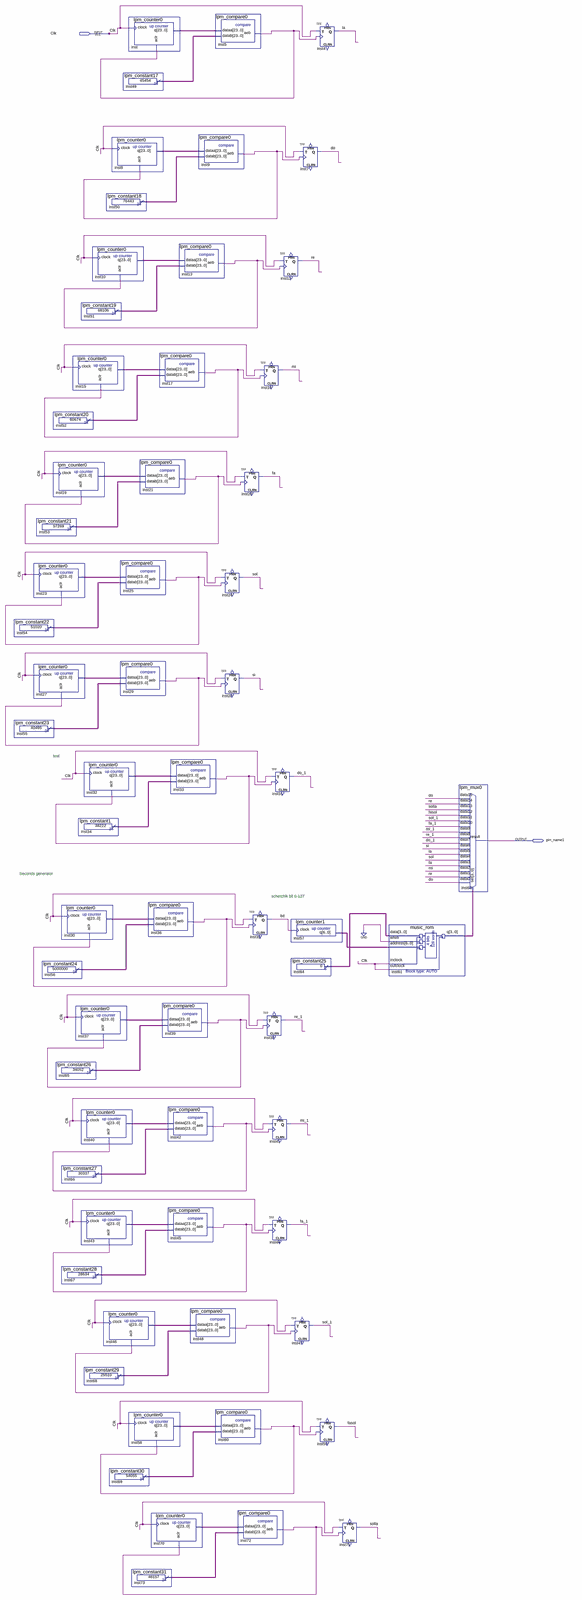
[diagram p0: schematic sheet, whole]
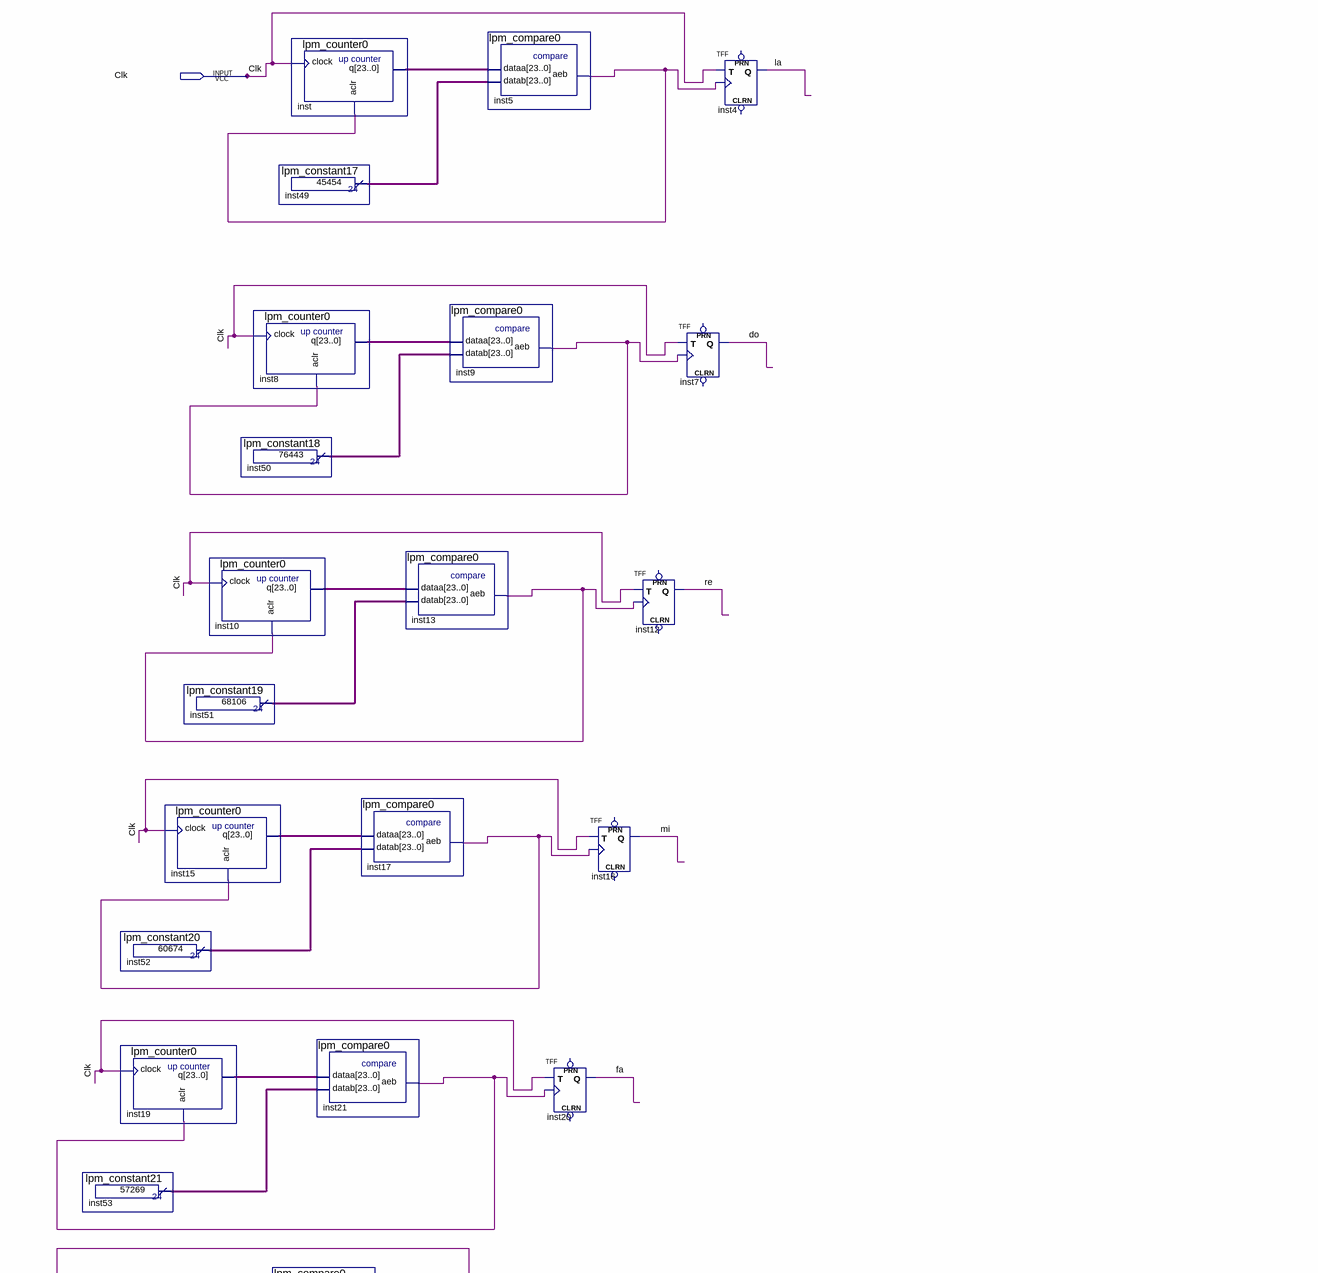
[diagram p1: schematic sheet, upper part]
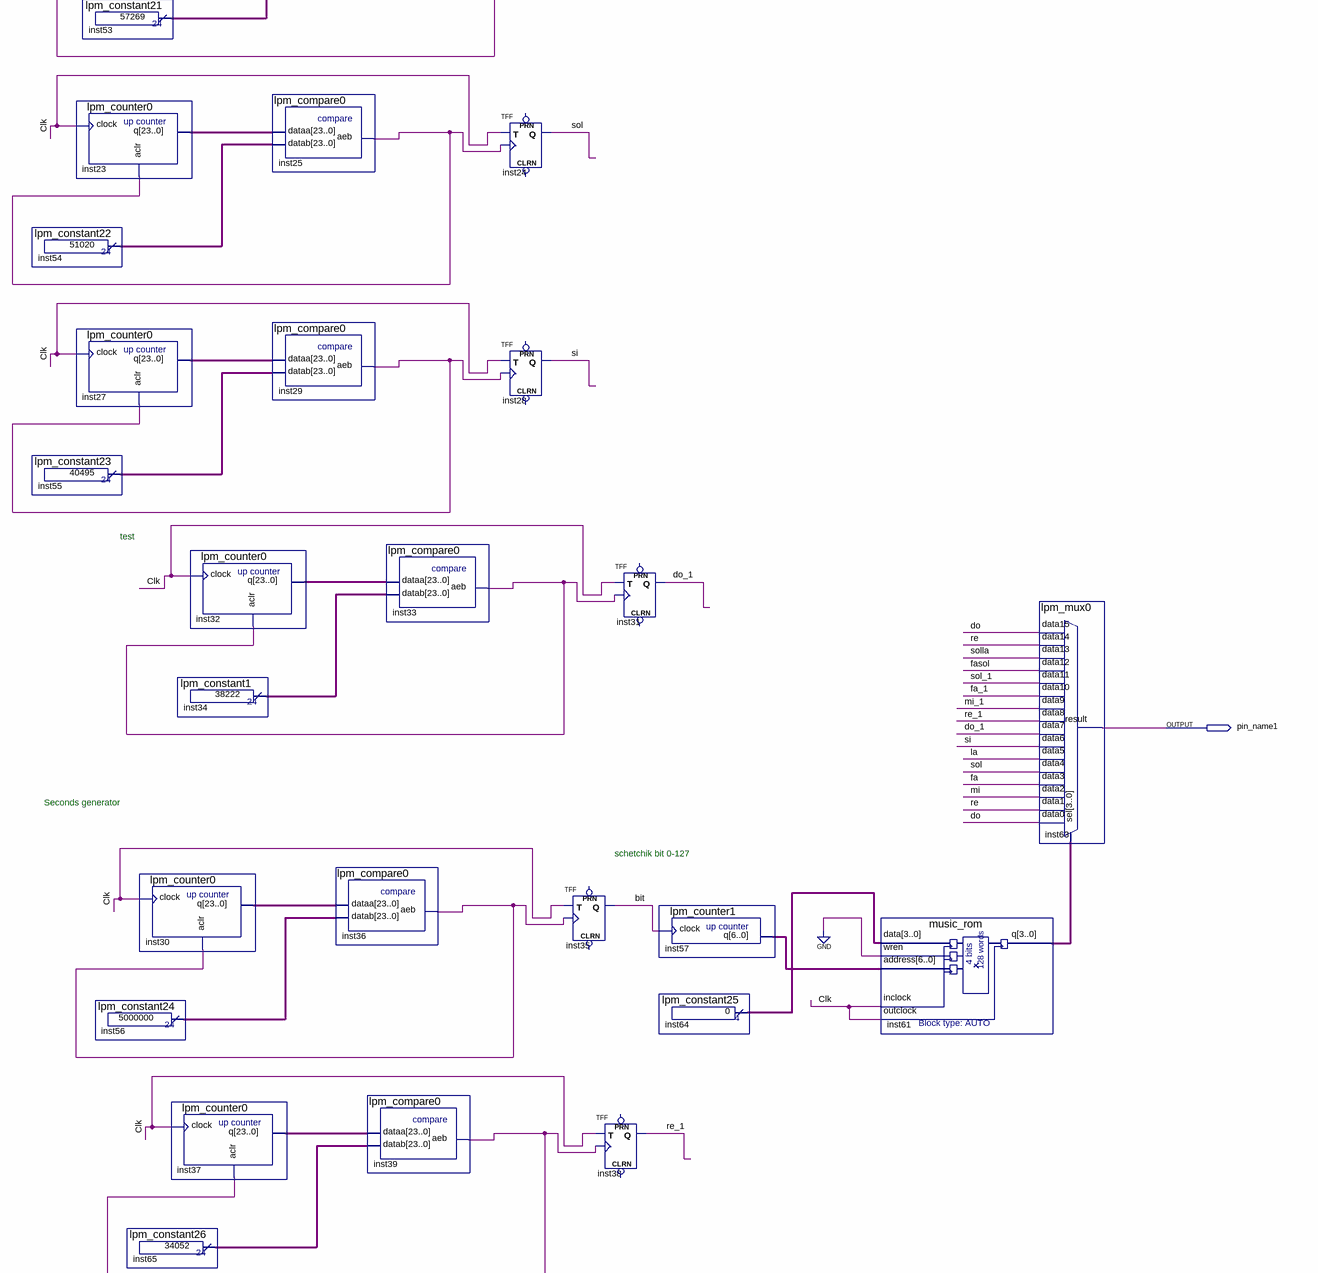
[diagram p2: schematic sheet, middle part]
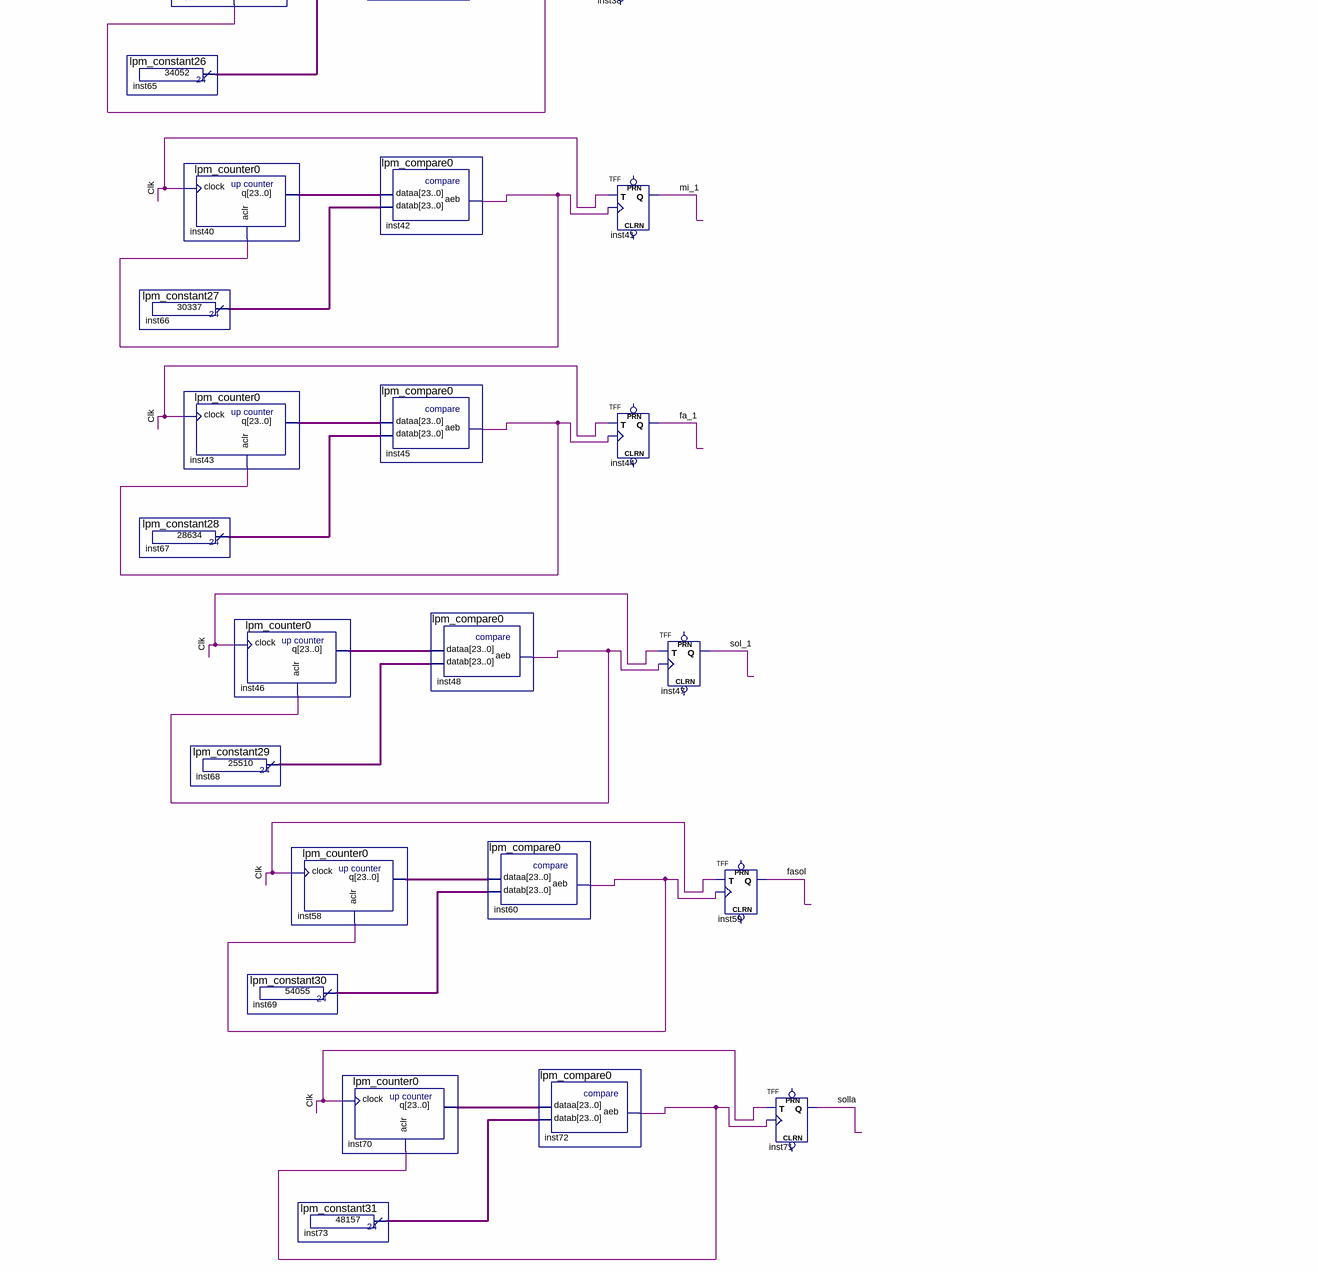
[diagram p3: schematic sheet, lower part]
// Quartus schematic MUSIC.bdf as structural Verilog: 64 symbols, 2 pins
module MUSIC (
  input  Clk,
  output pin_name1
);

  wire \bit , \do , do_1, fa, fa_1, fasol, inst5_aeb, inst9_aeb, inst13_aeb, inst17_aeb, inst21_aeb,
       inst25_aeb, inst29_aeb, inst33_aeb, inst36_aeb, inst39_aeb, inst42_aeb, inst45_aeb, inst48_aeb,
       inst60_aeb, inst72_aeb, la, mi, mi_1, re, re_1, si, sol, sol_1, solla;
  wire [3:0] inst61_q, inst64_result;
  wire [6:0] inst57_q;
  wire [23:0] inst8_q, inst10_q, inst15_q, inst19_q, inst23_q, inst27_q, inst30_q, inst32_q, inst34_result,
       inst37_q, inst40_q, inst43_q, inst46_q, inst49_result, inst50_result, inst51_result, inst52_result,
       inst53_result, inst54_result, inst55_result, inst56_result, inst58_q, inst65_result, inst66_result,
       inst67_result, inst68_result, inst69_result, inst70_q, inst73_result, inst_q;

  lpm_constant22 inst54 (.result(inst54_result));
  lpm_constant23 inst55 (.result(inst55_result));
  lpm_constant21 inst53 (.result(inst53_result));
  lpm_counter0 inst23 (.clock(Clk), .aclr(inst25_aeb), .q(inst23_q));
  lpm_counter0 inst27 (.clock(Clk), .aclr(inst29_aeb), .q(inst27_q));
  lpm_constant24 inst56 (.result(inst56_result));
  lpm_constant20 inst52 (.result(inst52_result));
  lpm_counter0 inst19 (.clock(Clk), .aclr(inst21_aeb), .q(inst19_q));
  lpm_counter0 inst30 (.clock(Clk), .aclr(inst36_aeb), .q(inst30_q));
  lpm_constant26 inst65 (.result(inst65_result));
  lpm_constant27 inst66 (.result(inst66_result));
  lpm_constant28 inst67 (.result(inst67_result));
  lpm_constant19 inst51 (.result(inst51_result));
  lpm_counter0 inst15 (.clock(Clk), .aclr(inst17_aeb), .q(inst15_q));
  lpm_counter0 inst32 (.clock(Clk), .aclr(inst33_aeb), .q(inst32_q));
  lpm_constant1 inst34 (.result(inst34_result));
  lpm_counter0 inst37 (.clock(Clk), .aclr(inst39_aeb), .q(inst37_q));
  lpm_counter0 inst40 (.clock(Clk), .aclr(inst42_aeb), .q(inst40_q));
  lpm_counter0 inst43 (.clock(Clk), .aclr(inst45_aeb), .q(inst43_q));
  lpm_constant29 inst68 (.result(inst68_result));
  lpm_constant18 inst50 (.result(inst50_result));
  lpm_counter0 inst10 (.clock(Clk), .aclr(inst13_aeb), .q(inst10_q));
  lpm_counter0 inst46 (.clock(Clk), .aclr(inst48_aeb), .q(inst46_q));
  lpm_constant30 inst69 (.result(inst69_result));
  lpm_counter0 inst (.clock(Clk), .aclr(inst5_aeb), .q(inst_q));
  lpm_constant17 inst49 (.result(inst49_result));
  lpm_counter0 inst8 (.clock(Clk), .aclr(inst9_aeb), .q(inst8_q));
  lpm_compare0 inst25 (.dataa(inst23_q), .datab(inst54_result), .aeb(inst25_aeb));
  lpm_compare0 inst29 (.dataa(inst27_q), .datab(inst55_result), .aeb(inst29_aeb));
  lpm_counter0 inst58 (.clock(Clk), .aclr(inst60_aeb), .q(inst58_q));
  lpm_constant31 inst73 (.result(inst73_result));
  lpm_compare0 inst21 (.dataa(inst19_q), .datab(inst53_result), .aeb(inst21_aeb));
  lpm_compare0 inst36 (.dataa(inst30_q), .datab(inst56_result), .aeb(inst36_aeb));
  lpm_counter0 inst70 (.clock(Clk), .aclr(inst72_aeb), .q(inst70_q));
  lpm_compare0 inst17 (.dataa(inst15_q), .datab(inst52_result), .aeb(inst17_aeb));
  lpm_compare0 inst33 (.dataa(inst32_q), .datab(inst34_result), .aeb(inst33_aeb));
  lpm_compare0 inst39 (.dataa(inst37_q), .datab(inst65_result), .aeb(inst39_aeb));
  lpm_compare0 inst42 (.dataa(inst40_q), .datab(inst66_result), .aeb(inst42_aeb));
  lpm_compare0 inst45 (.dataa(inst43_q), .datab(inst67_result), .aeb(inst45_aeb));
  lpm_compare0 inst9 (.dataa(inst8_q), .datab(inst50_result), .aeb(inst9_aeb));
  lpm_compare0 inst13 (.dataa(inst10_q), .datab(inst51_result), .aeb(inst13_aeb));
  lpm_compare0 inst48 (.dataa(inst46_q), .datab(inst68_result), .aeb(inst48_aeb));
  lpm_compare0 inst5 (.dataa(inst_q), .datab(inst49_result), .aeb(inst5_aeb));
  TFF inst24 (.T(Clk), .CLK(inst25_aeb), .Q(sol));  // open: PRN, CLRN
  TFF inst28 (.T(Clk), .CLK(inst29_aeb), .Q(si));  // open: PRN, CLRN
  lpm_compare0 inst60 (.dataa(inst58_q), .datab(inst69_result), .aeb(inst60_aeb));
  TFF inst20 (.T(Clk), .CLK(inst21_aeb), .Q(fa));  // open: PRN, CLRN
  lpm_compare0 inst72 (.dataa(inst70_q), .datab(inst73_result), .aeb(inst72_aeb));
  TFF inst16 (.T(Clk), .CLK(inst17_aeb), .Q(mi));  // open: PRN, CLRN
  TFF inst35 (.T(Clk), .CLK(inst36_aeb), .Q(\bit ));  // open: PRN, CLRN
  TFF inst38 (.T(Clk), .CLK(inst39_aeb), .Q(re_1));  // open: PRN, CLRN
  TFF inst12 (.T(Clk), .CLK(inst13_aeb), .Q(re));  // open: PRN, CLRN
  TFF inst31 (.T(Clk), .CLK(inst33_aeb), .Q(do_1));  // open: PRN, CLRN
  TFF inst41 (.T(Clk), .CLK(inst42_aeb), .Q(mi_1));  // open: PRN, CLRN
  TFF inst44 (.T(Clk), .CLK(inst45_aeb), .Q(fa_1));  // open: PRN, CLRN
  TFF inst7 (.T(Clk), .CLK(inst9_aeb), .Q(\do ));  // open: PRN, CLRN
  lpm_counter1 inst57 (.clock(\bit ), .q(inst57_q));
  lpm_constant25 inst64 (.result(inst64_result));
  TFF inst47 (.T(Clk), .CLK(inst48_aeb), .Q(sol_1));  // open: PRN, CLRN
  TFF inst4 (.T(Clk), .CLK(inst5_aeb), .Q(la));  // open: PRN, CLRN
  TFF inst59 (.T(Clk), .CLK(inst60_aeb), .Q(fasol));  // open: PRN, CLRN
  TFF inst71 (.T(Clk), .CLK(inst72_aeb), .Q(solla));  // open: PRN, CLRN
  music_rom inst61 (.data(inst64_result), .wren(1'b0), .address(inst57_q), .inclock(Clk), .outclock(Clk), .q(inst61_q));
  lpm_mux0 inst63 (
    .data15(\do ), .data14(re), .data13(solla), .data12(fasol), .data11(sol_1), .data10(fa_1), .data9(mi_1),
    .data8(re_1), .data7(do_1), .data6(si), .data5(la), .data4(sol), .data3(fa), .data2(mi), .data1(re),
    .data0(\do ), .sel(inst61_q), .result(pin_name1));

  // Notes on the sheet:
  //   test 
  //   Seconds generator             
  //   schetchik bit 0-127              
endmodule
